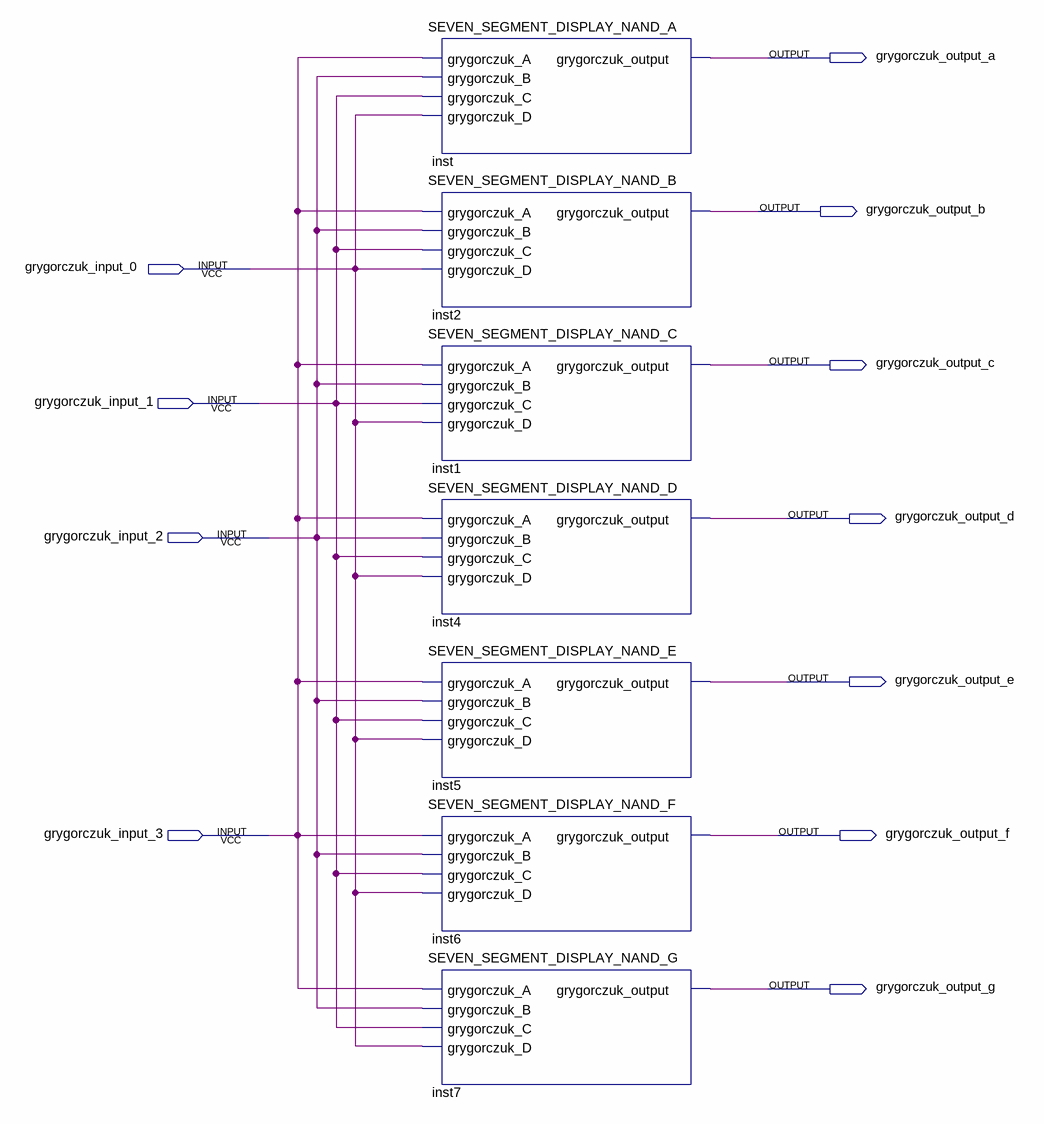
[diagram p0: schematic sheet]
// Quartus schematic SEVEN_SEGMENT_DISPLAY.bdf as structural Verilog: 7 symbols, 11 pins
module SEVEN_SEGMENT_DISPLAY (
  input  grygorczuk_input_0,
  input  grygorczuk_input_1,
  input  grygorczuk_input_2,
  input  grygorczuk_input_3,
  output grygorczuk_output_a,
  output grygorczuk_output_b,
  output grygorczuk_output_c,
  output grygorczuk_output_d,
  output grygorczuk_output_e,
  output grygorczuk_output_f,
  output grygorczuk_output_g
);

  SEVEN_SEGMENT_DISPLAY_NAND_A inst (
    .grygorczuk_A(grygorczuk_input_3), .grygorczuk_B(grygorczuk_input_2), .grygorczuk_C(grygorczuk_input_1),
    .grygorczuk_D(grygorczuk_input_0), .grygorczuk_output(grygorczuk_output_a));
  SEVEN_SEGMENT_DISPLAY_NAND_B inst2 (
    .grygorczuk_A(grygorczuk_input_3), .grygorczuk_B(grygorczuk_input_2), .grygorczuk_C(grygorczuk_input_1),
    .grygorczuk_D(grygorczuk_input_0), .grygorczuk_output(grygorczuk_output_b));
  SEVEN_SEGMENT_DISPLAY_NAND_C inst1 (
    .grygorczuk_A(grygorczuk_input_3), .grygorczuk_B(grygorczuk_input_2), .grygorczuk_C(grygorczuk_input_1),
    .grygorczuk_D(grygorczuk_input_0), .grygorczuk_output(grygorczuk_output_c));
  SEVEN_SEGMENT_DISPLAY_NAND_D inst4 (
    .grygorczuk_A(grygorczuk_input_3), .grygorczuk_B(grygorczuk_input_2), .grygorczuk_C(grygorczuk_input_1),
    .grygorczuk_D(grygorczuk_input_0), .grygorczuk_output(grygorczuk_output_d));
  SEVEN_SEGMENT_DISPLAY_NAND_E inst5 (
    .grygorczuk_A(grygorczuk_input_3), .grygorczuk_B(grygorczuk_input_2), .grygorczuk_C(grygorczuk_input_1),
    .grygorczuk_D(grygorczuk_input_0), .grygorczuk_output(grygorczuk_output_e));
  SEVEN_SEGMENT_DISPLAY_NAND_F inst6 (
    .grygorczuk_A(grygorczuk_input_3), .grygorczuk_B(grygorczuk_input_2), .grygorczuk_C(grygorczuk_input_1),
    .grygorczuk_D(grygorczuk_input_0), .grygorczuk_output(grygorczuk_output_f));
  SEVEN_SEGMENT_DISPLAY_NAND_G inst7 (
    .grygorczuk_A(grygorczuk_input_3), .grygorczuk_B(grygorczuk_input_2), .grygorczuk_C(grygorczuk_input_1),
    .grygorczuk_D(grygorczuk_input_0), .grygorczuk_output(grygorczuk_output_g));
endmodule
